# Altium schematic sheet LevelTranslator.SchDoc: LevelTranslator
size Letter; ApprovedBy: Kevin; Author: Jessica; Organization: Cegep Limoilou; Address1: 1300, 8e Avenue; Address2: Québec, QC; Address3: Canada; Address4: G1J 5L5; Revision: A; SheetNumber: 4; SheetTotal: 4
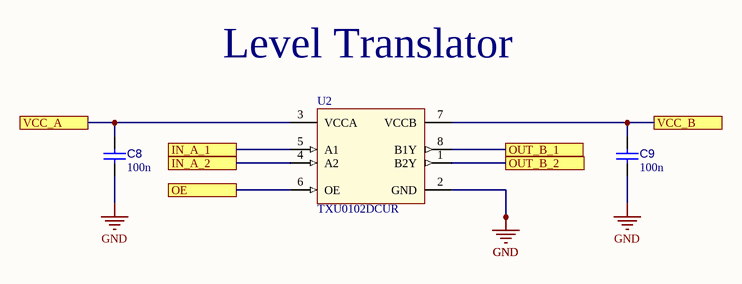
[diagram p0: LevelTranslator.SchDoc]

## Parts
C8  value 100n  [C_1608[0603]]  (hidden comment: CAP CER 100nF 50V 0603)
C9  value 100n  [C_1608[0603]]  (hidden comment: CAP CER 100nF 50V 0603)
U2  TXU0102DCUR  [U_VSSOP50P310X200X90-8N]

## Ports
IN_A_1, IN_A_2, OE, OUT_B_1, OUT_B_2, VCC_A, VCC_B

## Nets
GND: C8.1 C9.1 U2.2(GND)
IN_A_1: U2.5(A1) ; port IN_A_1
IN_A_2: U2.4(A2) ; port IN_A_2
OE: U2.6(OE) ; port OE
OUT_B_1: U2.8(B1Y) ; port OUT_B_1
OUT_B_2: U2.1(B2Y) ; port OUT_B_2
VCC_A: C8.2 U2.3(VCCA) ; port VCC_A
VCC_B: C9.2 U2.7(VCCB) ; port VCC_B

## Notes on the sheet
- Level Translator
- Titre :
- Conception :
- Date :
- Approbation :
- Heure :
- Révision :
- Feuille
- de
- Fichier :

## Library data of the parts
C8 C9 = CAP002: Capacitor type 1; Manufacturer 1: Yageo; Manufacturer Part Number 1: CC0603KRX7R9BB104; LibRef: CAP002; Code CEGEP: COND0143SM; Tolerance: 10%; Dielectric: X7R; Rated Voltage: 50V; Mounting Technology: SMT; Supplier 1: LCSC; Supplier Part Number 1: C14663
U2 = U_TXU0102DCU: Two channel fixed-direction level shifter 8-VSSOP; Manufacturer 1: TI; Manufacturer Part Number 1: TXU0102DCUR; Mounting Technology: SMT; Supplier 1: LCSC; Supplier 2: Digikey; Supplier Part Number 1: C5217871; Supplier Part Number 2: 296-TXU0102DCURCT-ND